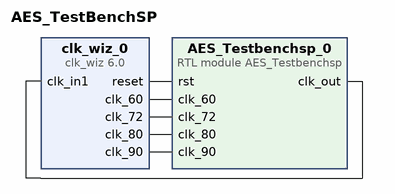
[diagram p0: block diagram of the top level]
# Vivado block design AES_TestBenchSP, xc7a35ticpg236-1L, Vivado 2023.2.1
create_bd_design AES_TestBenchSP

create_bd_cell -type module -reference AES_Testbenchsp AES_Testbenchsp_0
create_bd_cell -type ip -vlnv xilinx.com:ip:clk_wiz:6.0 clk_wiz_0
set_property -dict [list \
  CONFIG.CLKOUT1_JITTER 333.077 \
  CONFIG.CLKOUT1_PHASE_ERROR 328.297 \
  CONFIG.CLKOUT1_REQUESTED_OUT_FREQ 90 \
  CONFIG.CLKOUT1_USED true \
  CONFIG.CLKOUT2_JITTER 340.684 \
  CONFIG.CLKOUT2_PHASE_ERROR 328.297 \
  CONFIG.CLKOUT2_REQUESTED_OUT_FREQ 80 \
  CONFIG.CLKOUT2_USED true \
  CONFIG.CLKOUT3_JITTER 347.809 \
  CONFIG.CLKOUT3_PHASE_ERROR 328.297 \
  CONFIG.CLKOUT3_REQUESTED_OUT_FREQ 72 \
  CONFIG.CLKOUT3_USED true \
  CONFIG.CLKOUT4_JITTER 360.957 \
  CONFIG.CLKOUT4_PHASE_ERROR 328.297 \
  CONFIG.CLKOUT4_REQUESTED_OUT_FREQ 60 \
  CONFIG.CLKOUT4_USED true \
  CONFIG.CLK_OUT1_PORT clk_90 \
  CONFIG.CLK_OUT2_PORT clk_80 \
  CONFIG.CLK_OUT3_PORT clk_72 \
  CONFIG.CLK_OUT4_PORT clk_60 \
  CONFIG.MMCM_CLKFBOUT_MULT_F 36.000 \
  CONFIG.MMCM_CLKOUT0_DIVIDE_F 8.000 \
  CONFIG.MMCM_CLKOUT1_DIVIDE 9 \
  CONFIG.MMCM_CLKOUT2_DIVIDE 10 \
  CONFIG.MMCM_CLKOUT3_DIVIDE 12 \
  CONFIG.MMCM_DIVCLK_DIVIDE 5 \
  CONFIG.NUM_OUT_CLKS 4 \
] [get_bd_cells clk_wiz_0]

# ---- connections ----

connect_bd_net [get_bd_pins AES_Testbenchsp_0/clk_out] [get_bd_pins clk_wiz_0/clk_in1]
connect_bd_net [get_bd_pins clk_wiz_0/reset] [get_bd_pins AES_Testbenchsp_0/rst]
connect_bd_net [get_bd_pins clk_wiz_0/clk_60] [get_bd_pins AES_Testbenchsp_0/clk_60]
connect_bd_net [get_bd_pins clk_wiz_0/clk_72] [get_bd_pins AES_Testbenchsp_0/clk_72]
connect_bd_net [get_bd_pins clk_wiz_0/clk_80] [get_bd_pins AES_Testbenchsp_0/clk_80]
connect_bd_net [get_bd_pins clk_wiz_0/clk_90] [get_bd_pins AES_Testbenchsp_0/clk_90]

validate_bd_design
save_bd_design
